# Altium project ETRX_Shield.PrjPcb (part 1 of 3)
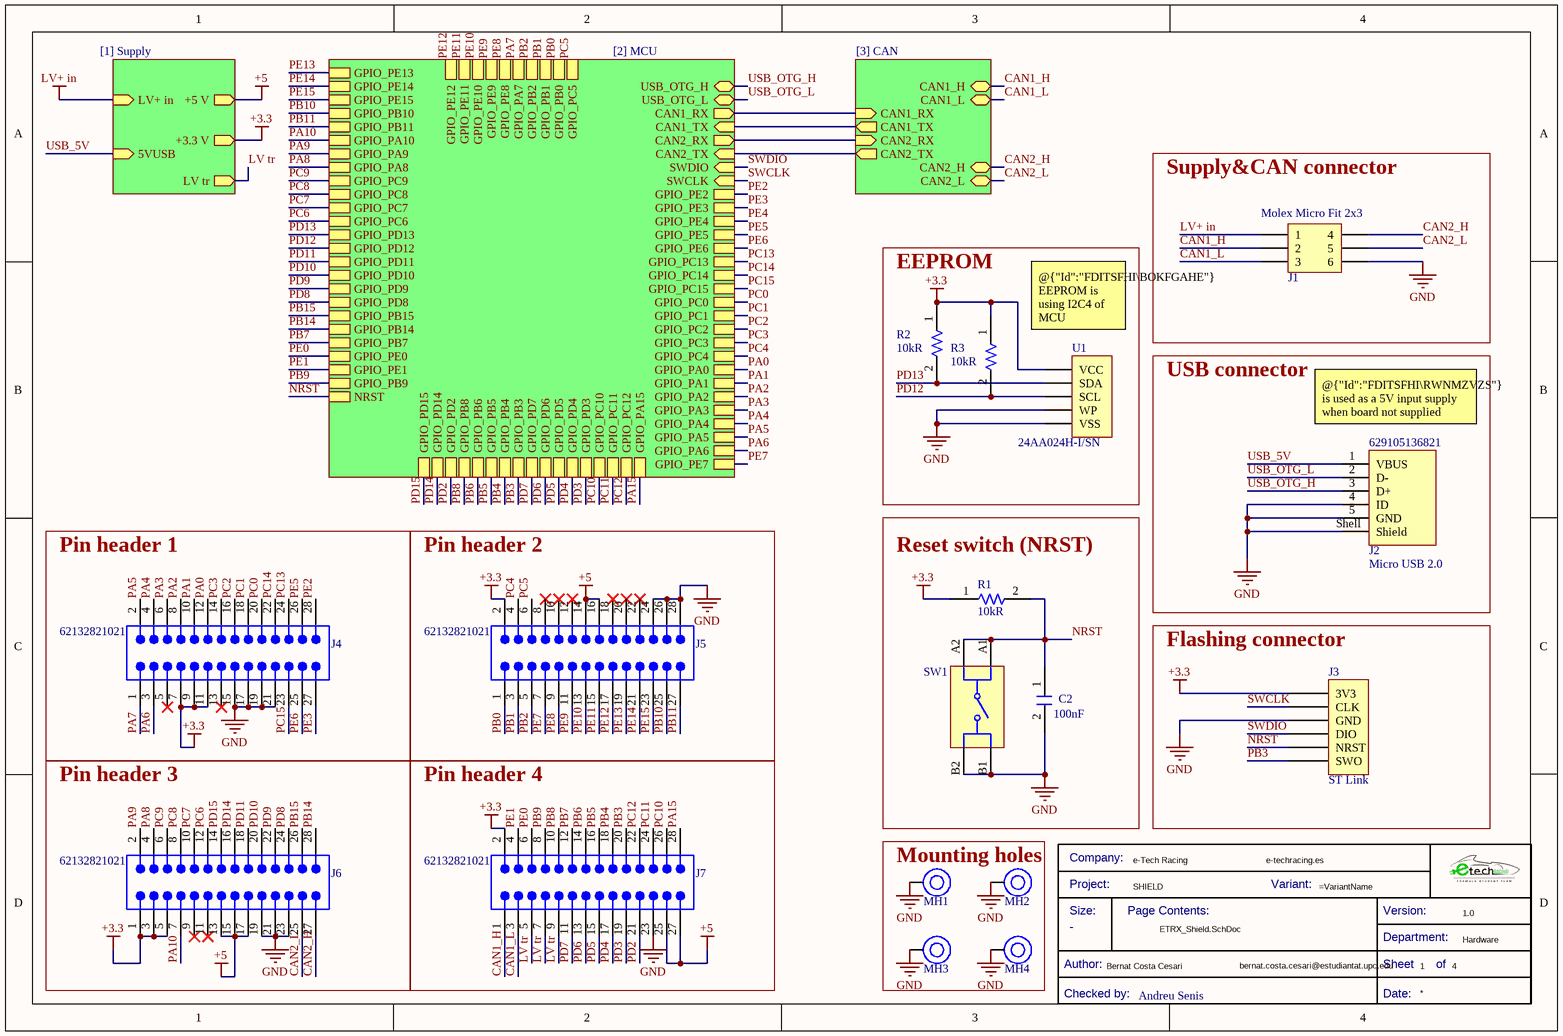
[diagram p0: ETRX_Shield.SchDoc]
Company: e-Tech Racing; Department: Hardware; DesignedByURL: e-techracing.es; DesignerMail: bernat.costa.cesari@estudiantat.upc.edu; DesignerName: Bernat Costa Cesari; Project: SHIELD; ReviewerName: Andreu Senis; Version: 1.0
4 sheets, 119 parts. Net scope: hierarchical (ports join the sheet entries above them; power ports are global).
Sheets:
  ETRX_Shield.SchDoc
    [1] Supply = [1] Supply.SchDoc
    [2] MCU = [2] MCU.SchDoc
    [3] CAN = [3] CAN.SchDoc

## Sheet ETRX_Shield.SchDoc
size A4; DocumentNumber: 1; SheetNumber: 1; SheetTotal: 4

### Parts
*  Checked by:: Andreu Senis  (hidden comment: Title Block_template)  (graphical)
C2  Capacitance: 100nF  [C0805FNPC-R]  (hidden comment: 885012207098)
J1  Molex Micro Fit 2x3  [J_MicroFit_2x3_V]
J2  629105136821  [629105136821]
J3  ST Link  [J_STLink_PinHeader]
J4  62132821021  [62132821021]
J5  62132821021  [62132821021]
J6  62132821021  [62132821021]
J7  62132821021  [62132821021]
MH1  Mounting_Hole_M3  [Mounting_Hole_M3]  (value not drawn)
MH2  Mounting_Hole_M3  [Mounting_Hole_M3]  (value not drawn)
MH3  Mounting_Hole_M3  [Mounting_Hole_M3]  (value not drawn)
MH4  Mounting_Hole_M3  [Mounting_Hole_M3]  (value not drawn)
R1  Resistance: 10kR  [R0805FTK]  (hidden comment: CR0805-JW-103ELF)
R2  Resistance: 10kR  [R0805FTK]  (hidden comment: CR0805-JW-103ELF)
R3  Resistance: 10kR  [R0805FTK]  (hidden comment: CR0805-JW-103ELF)
SW1  430773034825  [WS-TASV_L6W6H3.4_4307x30348xx]  (value not drawn)
U1  24AA024H-I/SN  [SOIC, 8-Leads 1,27mm]

### Blocks framed on the sheet
Supply&CAN connector: J1
EEPROM: R2 R3 U1
USB connector: J2
Reset switch (NRST): C2 R1 SW1
Pin header 1: J4
Pin header 2: J5
Flashing connector: J3
Pin header 3: J6
Pin header 4: J7
Mounting holes: MH1-MH4

### Sub-sheets
[1] Supply = [1] Supply: LV+ in (in), +5 V (out), +3.3 V (out), LV tr (out), 5VUSB (in)
[2] MCU = [2] MCU: CAN1_RX (out), CAN1_TX (in), CAN2_RX (out), CAN2_TX (in), USB_OTG_H (bidir), USB_OTG_L (bidir), SWDIO (in), SWCLK (in), GPIO_PE2, GPIO_PE3, GPIO_PE4, GPIO_PE5, GPIO_PC13, GPIO_PC14, GPIO_PC15, GPIO_PC0, GPIO_PC1, GPIO_PC2, GPIO_PC3, GPIO_PA0, GPIO_PA1, GPIO_PA2, GPIO_PA3, GPIO_PA4, GPIO_PA5, GPIO_PC4, GPIO_PC5, GPIO_PB0, GPIO_PB1, GPIO_PB2, GPIO_PE8, GPIO_PE9, GPIO_PE10, GPIO_PE11, GPIO_PE12, GPIO_PE13, GPIO_PE14, GPIO_PE15, GPIO_PB10, GPIO_PB11, GPIO_PA8, GPIO_PC9, GPIO_PC8, GPIO_PC7, GPIO_PC6, GPIO_PD13, GPIO_PD12, GPIO_PD11, GPIO_PD10, GPIO_PD9, GPIO_PD8, GPIO_PB15, GPIO_PB14, GPIO_PB7, GPIO_PE1, GPIO_PE0, GPIO_PB9, GPIO_PB8, GPIO_PB6, GPIO_PB5, GPIO_PB4, GPIO_PB3, GPIO_PD7, GPIO_PD6, GPIO_PD5, GPIO_PD4, GPIO_PD3, GPIO_PD2, GPIO_PC12, GPIO_PC11, GPIO_PC10, GPIO_PA15, GPIO_PA10, GPIO_PE6, GPIO_PA6, GPIO_PA7, GPIO_PE7, NRST, GPIO_PD14, GPIO_PD15, GPIO_PA9
[3] CAN = [3] CAN: CAN1_H (bidir), CAN1_L (bidir), CAN2_H (bidir), CAN2_L (bidir), CAN1_RX (in), CAN2_RX (in), CAN1_TX (out), CAN2_TX (out)

### Nets
+3.3: J3.1(3V3) J4.7 J4.9 J4.11 J5.2 J6.1 J6.3 J6.5 J7.2 R1.1 R2.1 R3.1 U1.8(VCC) ; sheet [1] Supply/+3.3 V
+5: J5.14 J5.16 J6.13 J6.15 J6.17 J7.25 J7.27 ; sheet [1] Supply/+5 V
GND: C2.2 J1.6 J2.4(ID) J2.5(GND) J2.Shell(Shield) J3.3(GND) J4.15 J4.17 J4.19 J4.21 J5.24 J5.26 J5.28 J6.19 J6.21 J6.23 J7.23 MH1.1 MH2.1 MH3.1 MH4.1 SW1.B1 SW1.B2 U1.4(VSS) U1.7(WP)
LV+ in: J1.1 ; sheet [1] Supply/LV+ in
CAN1_H: J1.2 J7.1 ; sheet [3] CAN/CAN1_H
CAN1_L: J1.3 J7.3 ; sheet [3] CAN/CAN1_L
CAN1_RX: sheet [2] MCU/CAN1_RX, sheet [3] CAN/CAN1_RX
CAN1_TX: sheet [2] MCU/CAN1_TX, sheet [3] CAN/CAN1_TX
CAN2_H: J1.4 J6.27 ; sheet [3] CAN/CAN2_H
CAN2_L: J1.5 J6.25 ; sheet [3] CAN/CAN2_L
CAN2_RX: sheet [2] MCU/CAN2_RX, sheet [3] CAN/CAN2_RX
CAN2_TX: sheet [2] MCU/CAN2_TX, sheet [3] CAN/CAN2_TX
LV tr: J7.5 J7.7 J7.9 ; sheet [1] Supply/LV tr
NRST: C2.1 J3.5(NRST) R1.2 SW1.A1 SW1.A2 ; sheet [2] MCU/NRST
PA0: J4.12 ; sheet [2] MCU/GPIO_PA0
PA1: J4.10 ; sheet [2] MCU/GPIO_PA1
PA2: J4.8 ; sheet [2] MCU/GPIO_PA2  [project net LED_PA2]
PA3: J4.6 ; sheet [2] MCU/GPIO_PA3  [project net LED_PA3]
PA4: J4.4 ; sheet [2] MCU/GPIO_PA4  [project net LED_PA4]
PA5: J4.2 ; sheet [2] MCU/GPIO_PA5
PA6: J4.3 ; sheet [2] MCU/GPIO_PA6
PA7: J4.1 ; sheet [2] MCU/GPIO_PA7
PA8: J6.4 ; sheet [2] MCU/GPIO_PA8
PA9: J6.2 ; sheet [2] MCU/GPIO_PA9
PA10: J6.7 ; sheet [2] MCU/GPIO_PA10
PA15: J7.28 ; sheet [2] MCU/GPIO_PA15
PB0: J5.1 ; sheet [2] MCU/GPIO_PB0
PB1: J5.3 ; sheet [2] MCU/GPIO_PB1
PB2: J5.5 ; sheet [2] MCU/GPIO_PB2
PB3: J3.6(SWO) J7.20 ; sheet [2] MCU/GPIO_PB3
PB4: J7.18 ; sheet [2] MCU/GPIO_PB4
PB5: J7.16 ; sheet [2] MCU/GPIO_PB5
PB6: J7.14 ; sheet [2] MCU/GPIO_PB6
PB7: J7.12 ; sheet [2] MCU/GPIO_PB7
PB8: J7.10 ; sheet [2] MCU/GPIO_PB8
PB9: J7.8 ; sheet [2] MCU/GPIO_PB9
PB10: J5.25 ; sheet [2] MCU/GPIO_PB10
PB11: J5.27 ; sheet [2] MCU/GPIO_PB11
PB14: J6.28 ; sheet [2] MCU/GPIO_PB14
PB15: J6.26 ; sheet [2] MCU/GPIO_PB15
PC0: J4.20 ; sheet [2] MCU/GPIO_PC0
PC1: J4.18 ; sheet [2] MCU/GPIO_PC1
PC2: J4.16 ; sheet [2] MCU/GPIO_PC2
PC3: J4.14 ; sheet [2] MCU/GPIO_PC3
PC4: J5.4 ; sheet [2] MCU/GPIO_PC4
PC5: J5.6 ; sheet [2] MCU/GPIO_PC5
PC6: J6.12 ; sheet [2] MCU/GPIO_PC6
PC7: J6.10 ; sheet [2] MCU/GPIO_PC7
PC8: J6.8 ; sheet [2] MCU/GPIO_PC8
PC9: J6.6 ; sheet [2] MCU/GPIO_PC9
PC10: J7.26 ; sheet [2] MCU/GPIO_PC10
PC11: J7.24 ; sheet [2] MCU/GPIO_PC11
PC12: J7.22 ; sheet [2] MCU/GPIO_PC12
PC13: J4.24 ; sheet [2] MCU/GPIO_PC13
PC14: J4.22 ; sheet [2] MCU/GPIO_PC14
PC15: J4.23 ; sheet [2] MCU/GPIO_PC15
PD2: J7.21 ; sheet [2] MCU/GPIO_PD2
PD3: J7.19 ; sheet [2] MCU/GPIO_PD3
PD4: J7.17 ; sheet [2] MCU/GPIO_PD4
PD5: J7.15 ; sheet [2] MCU/GPIO_PD5
PD6: J7.13 ; sheet [2] MCU/GPIO_PD6
PD7: J7.11 ; sheet [2] MCU/GPIO_PD7
PD8: J6.24 ; sheet [2] MCU/GPIO_PD8
PD9: J6.22 ; sheet [2] MCU/GPIO_PD9
PD10: J6.20 ; sheet [2] MCU/GPIO_PD10
PD11: J6.18 ; sheet [2] MCU/GPIO_PD11
PD12: R3.2 U1.6(SCL) ; sheet [2] MCU/GPIO_PD12
PD13: R2.2 U1.5(SDA) ; sheet [2] MCU/GPIO_PD13
PD14: J6.16 ; sheet [2] MCU/GPIO_PD14
PD15: J6.14 ; sheet [2] MCU/GPIO_PD15
PE0: J7.6 ; sheet [2] MCU/GPIO_PE0
PE1: J7.4 ; sheet [2] MCU/GPIO_PE1
PE2: J4.28 ; sheet [2] MCU/GPIO_PE2
PE3: J4.27 ; sheet [2] MCU/GPIO_PE3
PE5: J4.26 ; sheet [2] MCU/GPIO_PE5
PE6: J4.25 ; sheet [2] MCU/GPIO_PE6
PE7: J5.7 ; sheet [2] MCU/GPIO_PE7
PE8: J5.9 ; sheet [2] MCU/GPIO_PE8
PE9: J5.11 ; sheet [2] MCU/GPIO_PE9
PE10: J5.13 ; sheet [2] MCU/GPIO_PE10
PE11: J5.15 ; sheet [2] MCU/GPIO_PE11
PE12: J5.17 ; sheet [2] MCU/GPIO_PE12
PE13: J5.19 ; sheet [2] MCU/GPIO_PE13
PE14: J5.21 ; sheet [2] MCU/GPIO_PE14
PE15: J5.23 ; sheet [2] MCU/GPIO_PE15
SWCLK: J3.2(CLK) ; sheet [2] MCU/SWCLK
SWDIO: J3.4(DIO) ; sheet [2] MCU/SWDIO
USB_5V: J2.1(VBUS) ; sheet [1] Supply/5VUSB  [project net USB5V]
USB_OTG_H: J2.3(D+) ; sheet [2] MCU/USB_OTG_H
USB_OTG_L: J2.2(D-) ; sheet [2] MCU/USB_OTG_L

Not connected (* = marked no-connect by the designer): J4 5* 13*; J5 8* 10* 12* 18* 20* 22*; J6 9* 11*

### Notes on the sheet
- @{"Id":"FDITSFHI\BOKFGAHE"} EEPROM is using I2C4 of MCU
- (near J2) @{"Id":"FDITSFHI\RWNMZVZS"} is used as a 5V input supply when board not supplied externaly
- (near J2) Micro USB 2.0
- (in symbol Title Block_template) Company:; Project:; Variant:; Size:; Page Contents:; Version:; Department:; Author:; Sheet; of; Checked by:; Date:

### Library data of the parts
* = Title Block_template: Standard Title Block; .Creator: GP; Category: Title Block; .PCBcheck: GP; .SCHcheck: GP; Size: -
C2 = C100n-50V-0805FNPC-X7R: Cap, 0.1ΜF, 50V, 10%, X7R, 0805; Manufacturer 1: Wurth Electronics; .Creator: DR; Supplier 1: RSComponents; Manufacturer Part Number 1: 885012207098; RoHS: Yes; Category: Ceramic Capacitors; Stock 1: 8000; Pricing 1: 100=0,10200, 500=0,07100, 2000=0,06100 (GBP); Mount: Surface Mount; Case/Package: 0805; Case Code (Metric): 2012; Case Code (Imperial): 0805; Min Operating Temperature: -55°C; Max Operating Temperature: 125°C; Packaging: Cut Tape; Voltage Rating: 50V; Dielectric: X7R; Tolerance: 10%; Voltage Rating (DC): 50V; Length: 0.079inch; Width: 0.049inch; Thickness: 0.035inch; REACH SVHC: Unknown; RoHS Compliant: Yes; ComponentLink1URL: http://www.farnell.com/datasheets/1958498.pdf?src-supplier=Farnell; ComponentLink1Description: http://www.farnell.com/datasheets/1958498.pdf?src-supplier=Farnell; ComponentLink2URL: http://www.farnell.com/datasheets/1958498.pdf?src-supplier=Element14; ComponentLink2Description: http://www.farnell.com/datasheets/1958498.pdf?src-supplier=Element14; ComponentLink3URL: https://katalog.we-online.de/pbs/datasheet/885012207098.pdf?src-supplier=Digi-Key; ComponentLink3Description: https://katalog.we-online.de/pbs/datasheet/885012207098.pdf?src-supplier=Digi-Key; ComponentLink4URL: http://www.farnell.com/datasheets/1958498.pdf?src-supplier=Newark; ComponentLink4Description: http://www.farnell.com/datasheets/1958498.pdf?src-supplier=Newark; Supplier Part Number 1: 1813493
J1 = J_MicroFit_2x3_V: Micro fit Header, 2 Row, Vertical, Polarizing Peg, 6 Pin, Tin Plate, SMT/Glow Wire, Kinked Leads; Manufacturer Part Number: 43045-0612; .Creator: DO; ComponentLink8Description: Where buy it; ComponentLink8URL: https://www.molex.com/molex/products/part-detail/pcb_headers/0430450612; Supplier 1: RSComponents; Manufacturer: Molex; RoHS: Yes; Category: Headers and Wire Housings; Stock 1: 2635; Pricing 1: 5=1,45500, 100=1,26700, 375=1,08900, 1500=0,90900, 3000=0,72900 (USD); ComponentLink1URL: https://www.molex.com/pdm_docs/sd/430450612_sd.pdf; ComponentLink1Description: Datasheet; ComponentLink2URL: https://datasheet.ciiva.com/11748/0900766b800bd7d2-11748707.pdf?src-supplier=RSComponents; ComponentLink2Description: https://datasheet.ciiva.com/11748/0900766b800bd7d2-11748707.pdf?src-supplier=RSComponents; ComponentLink3URL: https://datasheet.ciiva.com/19462/883464-19462371.pdf?src-supplier=Jameco; ComponentLink3Description: https://datasheet.ciiva.com/19462/883464-19462371.pdf?src-supplier=Jameco; ComponentLink4URL: https://datasheet.ciiva.com/30194/128550430450612-pcb-headers-30194512.pdf?src-supplier=Onlinecomponents.com; ComponentLink4Description: https://datasheet.ciiva.com/30194/128550430450612-pcb-headers-30194512.pdf?src-supplier=Onlinecomponents.com; ComponentLink5URL: https://datasheet.ciiva.com/9468/0430450612-pcb-headers-9468492.pdf?src-supplier=Avnet; ComponentLink5Description: https://datasheet.ciiva.com/9468/0430450612-pcb-headers-9468492.pdf?src-supplier=Avnet; Supplier Part Number 1: 2332898
J2 = 629105136821: WR-COM Micro USB 2.0 SMT Type B Horizontal 5 Contacts; Manufacturer: Wurth Elektronik; Match Code: WR-USB; Gender: Receptacle; Interface Type: Type B; Number of Ports: 1; Rated Current: 1A; Working Voltage: 30V (AC); Manufacturer Part Number: 629105136821; Category: Input/Output Connectors; ComponentLink1Description: Website Link; ComponentLink1URL: https://www.we-online.com/redexpert/article/629105136821?ad; ComponentLink2Description: Datasheet Link; ComponentLink2URL: https://www.we-online.com/redexpert/spec/629105136821?ad; Mount: Surface Mount; Operating Temperature Max: 105°C; Operating Temperature Min: -40°C; Packaging: Tape and Reel; Application: Micro USB 2.0; Number of Pins: 5; Orientation: Horizontal
J3 = J_STLink_STM32_PinHeader_1x6
J4-J7 = 62132821021: WR-PHD Pin Header, SMT, Vertical, pitch 1.27mm, 2 Row, 28P; Manufacturer: Wurth Elektronik; Contact Resistance: 20mΩ; Rated Current: 1A; Working Voltage: 100V; Withstanding Voltage: 500V; ComponentLink1Description: Website Link; ComponentLink1URL: https://www.we-online.com/redexpert/article/62132821021?ad; ComponentLink2Description: Datasheet Link; ComponentLink2URL: https://www.we-online.com/redexpert/spec/62132821021?ad; Manufacturer Part Number: 62132821021; Category: Board-to-Board Connectors; Match Code: WR-PHD; Mount: Surface Mount; Operating Temperature Max: 105°C; Operating Temperature Min: -40°C; Packaging: Tape and Reel; Gender: Pin Header; Number of Pins: 28; Number of Rows: 2; Orientation: Vertical; Pitch: 1.27mm
R1-R3 = R10k-0805FTK: BOURNS         CR0805-JW-103ELF            Surface Mount Chip Resistor, Thick Film, CR Series, 10 kohm, 125 mW,  5%, 150 V; Temperature Coefficient: 200ppm/°C; Power Rating: 125mW; Voltage Rating: 150V; Voltage Rating (DC): 100V; .Creator: DR; Supplier 1: Arrow Electronics; Manufacturer 1: Bourns; Manufacturer Part Number 1: CR0805-JW-103ELF; RoHS: Yes; Category: Chip SMD Resistors; Stock 1: 57566; Pricing 1: 1=0,05790, 10=0,01540, 25=0,01340, 100=0,00340 (USD); Mount: Surface Mount; Case/Package: 0805; Number of Pins: 2; Contact Plating: Tin; Case Code (Metric): 2012; Case Code (Imperial): 0805; Min Operating Temperature: -55°C; Max Operating Temperature: 155°C; Tolerance: 5%; Resistor Type: Thick Film; Package Quantity: 1; Packaging: Tape and Reel; Number of Terminations: 2; Termination: SMD/SMT; Max Power Dissipation: 125mW; Features: Moisture Resistant; Series: CR0805; Construction: Rectangular; Resistance Tolerance: 5%; Technology: THICK FILM; Length: 2mm; Width: 1.25mm; Height: 0.5mm; Depth: 1.25mm; Thickness: 508um; Radiation Hardening: No; REACH SVHC: No SVHC; Military Standard: Not; RoHS Compliant: Yes; ComponentLink1URL: https://datasheet.ciiva.com/11821/0900766b80fcdb72-11821135.pdf?src-supplier=RSComponents; ComponentLink1Description: https://datasheet.ciiva.com/11821/0900766b80fcdb72-11821135.pdf?src-supplier=RSComponents; ComponentLink2URL: https://datasheet.ciiva.com/9122/chpreztr-9122374.pdf?src-supplier=Avnet; ComponentLink2Description: https://datasheet.ciiva.com/9122/chpreztr-9122374.pdf?src-supplier=Avnet; ComponentLink3URL: https://datasheet.ciiva.com/22693/1902866-22693254.pdf?src-supplier=Element14; ComponentLink3Description: https://datasheet.ciiva.com/22693/1902866-22693254.pdf?src-supplier=Element14; ComponentLink4URL: https://datasheet.ciiva.com/7986/691949-7986187.pdf?src-supplier=Element14; ComponentLink4Description: https://datasheet.ciiva.com/7986/691949-7986187.pdf?src-supplier=Element14; ComponentLink5URL: https://datasheet.ciiva.com/30065/159chpreztr-30065976.pdf?src-supplier=Onlinecomponents.com; ComponentLink5Description: https://datasheet.ciiva.com/30065/159chpreztr-30065976.pdf?src-supplier=Onlinecomponents.com; ComponentLink6URL: https://datasheet.ciiva.com/16783/70154685-16783482.pdf?src-supplier=Allied+Electronics; ComponentLink6Description: https://datasheet.ciiva.com/16783/70154685-16783482.pdf?src-supplier=Allied+Electronics; ComponentLink7URL: https://datasheet.ciiva.com/5548/chpreztr-5548491.pdf?src-supplier=Mouser; ComponentLink7Description: https://datasheet.ciiva.com/5548/chpreztr-5548491.pdf?src-supplier=Mouser; ComponentLink8URL: https://datasheet.ciiva.com/6559/chpreztr-6559900.pdf?src-supplier=Digi-Key; ComponentLink8Description: https://datasheet.ciiva.com/6559/chpreztr-6559900.pdf?src-supplier=Digi-Key; ComponentLink9URL: https://datasheet.ciiva.com/6559/chpreztr-6559901.pdf?src-supplier=Digi-Key; ComponentLink9Description: https://datasheet.ciiva.com/6559/chpreztr-6559901.pdf?src-supplier=Digi-Key; ComponentLink10URL: https://datasheet.ciiva.com/7985/1856384-7985869.pdf?src-supplier=Element14; ComponentLink10Description: https://datasheet.ciiva.com/7985/1856384-7985869.pdf?src-supplier=Element14; ComponentLink11URL: https://datasheet.ciiva.com/48692/001055517-da-01-en-smd-wid-cr0805-jw-103elf-10k-ohm-1-8w-48692118.pdf?src-supplier=Conrad; ComponentLink11Description: https://datasheet.ciiva.com/48692/001055517-da-01-en-smd-wid-cr0805-jw-103elf-10k-ohm-1-8w-48692118.pdf?src-supplier=Conrad; Supplier Part Number 1: CR0805-JW-103ELF
SW1 = 430773034825: WS-TASV J-Hook SMT Hermetic Tact Switch, L6 x W6 x H3.4mm, 250g, SPST-NO, 12V, 50mA; Manufacturer: Wurth Elektronik; Washable: Yes; Manufacturer Part Number: 430773034825; Category: Tact Switches; Match Code: WS-TASV; ComponentLink1Description: Website Link; ComponentLink1URL: https://www.we-online.com/redexpert/article/430773034825?ad; ComponentLink2Description: Datasheet Link; ComponentLink2URL: https://www.we-online.com/redexpert/spec/430773034825?ad; Mount: Surface Mount; Operating Temperature Max: 85°C; Operating Temperature Min: -40°C; Packaging: Tape and Reel; Length: 6mm; Width: 6mm; Height: 3.4mm; Circuit: SPST-NO; Contact Material: Stainless Steel; Contact Plating: Silver; Operation Force: 250g; Rated Current: 50mA; Rated Voltage (DC): 12V; Terminal Material: Copper Alloy; Terminal Plating: Silver
U1 = EEPROM 24AA02I2C 2K Microchip: 24AA02 / 2Kb I2C compatible 2-wire Serial EEPROM; Supplier 1: Arrow Electronics; Supplier Part Number 1: 24AA02-I/SN; ComponentLink1Description: Datasheet; ComponentLink1URL: https://ww1.microchip.com/downloads/aemDocuments/documents/MPD/ProductDocuments/DataSheets/24AA02-24LC02B-24FC02-2K-I2C-Serial-EEPROM-20001709N.pdf

## Sheet [1] Supply.SchDoc
size A4; DocumentNumber: 2; SheetNumber: 2; SheetTotal: 4
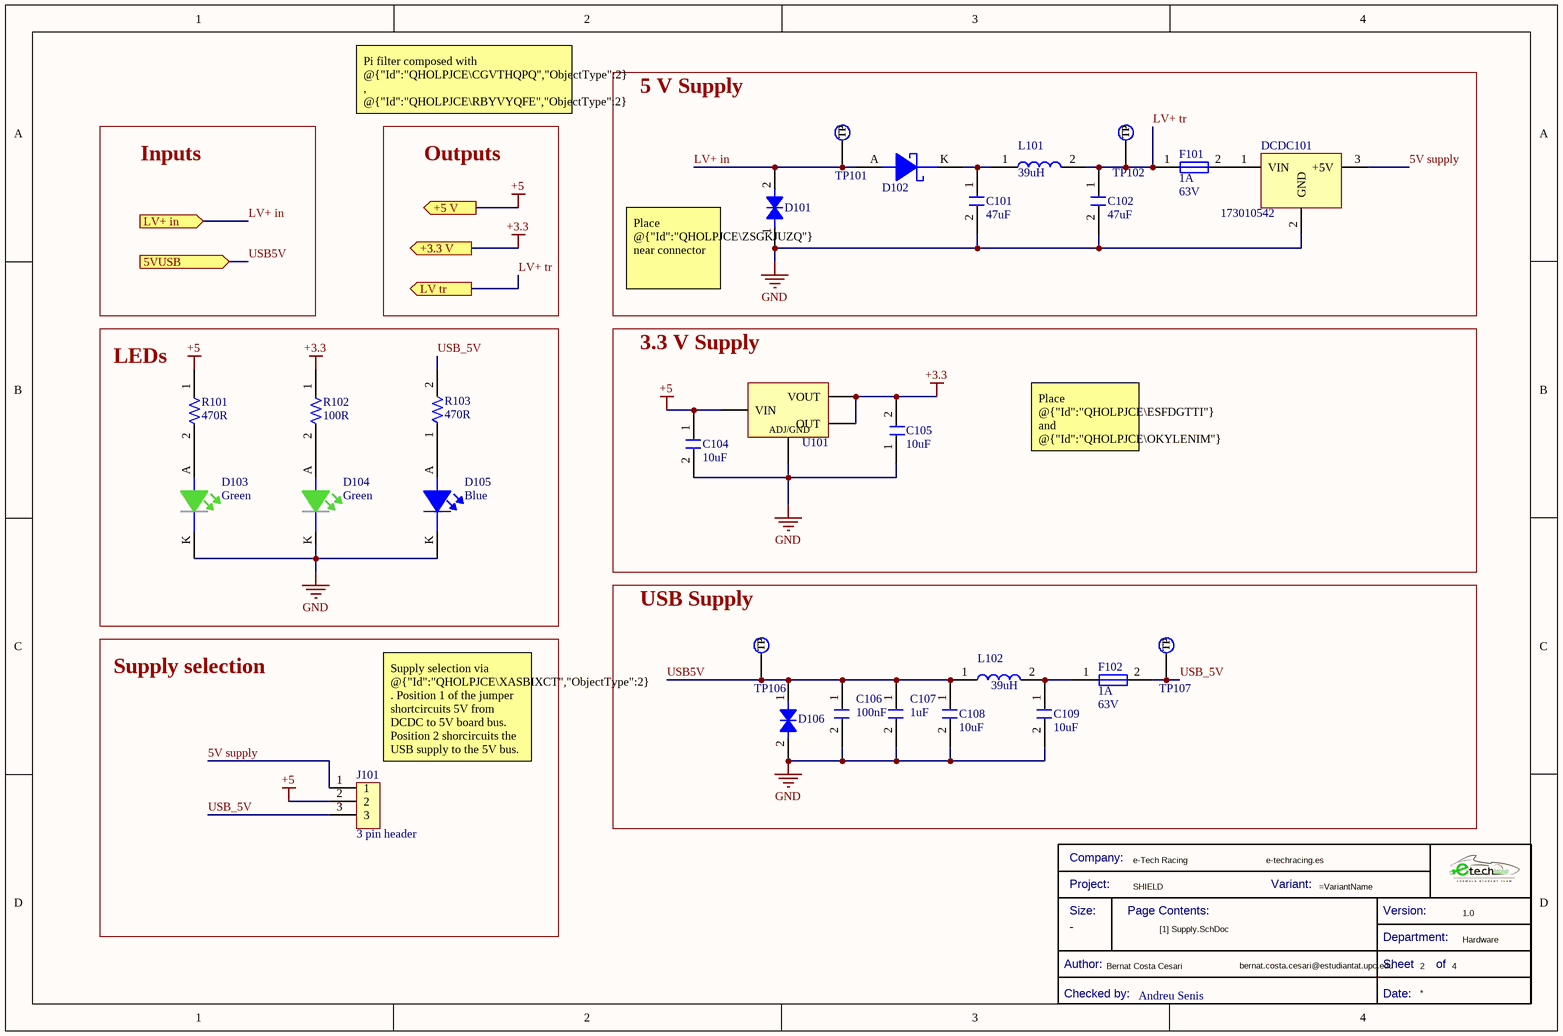
[diagram p1: [1] Supply.SchDoc]

### Parts
(Parts that share a designator on the sheet are numbered #1, #2 ... from top to bottom, then left to right.)
*?#1  Checked by:: Andreu Senis  (hidden comment: Title Block_template)  (graphical)
C101  Capacitance: 47uF  [C6.8n-2kV-1210FNPMLCC-X7R]  (hidden comment: C1210C682KGRACAUTO)
C102  Capacitance: 47uF  [C6.8n-2kV-1210FNPMLCC-X7R]  (hidden comment: C1210C682KGRACAUTO)
C104  Capacitance: 10uF  [C0805FNPC-R]  (hidden comment: 885012107014)
C105  Capacitance: 10uF  [C0805FNPC-R]  (hidden comment: 885012107014)
C106  Capacitance: 100nF  [C0805FNPC-R]  (hidden comment: 885012207098)
C107  Capacitance: 1uF  [C0805FNPC-R]  (hidden comment: 885012207103)
C108  10uF  [C0805FNPC-W]
C109  10uF  [C0805FNPC-W]
D101  824501261  [DTVS-DO-214AC]  (value not drawn)
D102  MBR0530  [DSC-SOD123]  (value not drawn)
D103  Color: Green  [LED_0805_WE]  (hidden comment: 150080GS75000)
D104  Color: Green  [LED_0805_WE]  (hidden comment: 150080GS75000)
D105  Color: Blue  [LED_1206_WE]  (hidden comment: 150120BS75000)
D106  824501131  [DTVS-DO-214AC]  (value not drawn)
DCDC101  173010542  [DCDC_Magi3c]
F101  Current Rating: 1A  Voltage Rating (DC): 63V  [Fuse_1206]  (hidden comment: 0437001.WRA)
F102  Current Rating: 1A  Voltage Rating (DC): 63V  [Fuse_1206]  (hidden comment: 0437001.WRA)
J101  3 pin header  [J3_PINHEADER]
L101  39uH  [L_47u-490mA_CF]
L102  39uH  [L_47u-490mA_CF]
R101  Resistance: 470R  [R0805FTK]  (hidden comment: CR0805-FX-4700GLF)
R102  Resistance: 100R  [R0805FTK]  (hidden comment: CR0805-FX-1000ELF)
R103  Resistance: 470R  [R0805FTK]  (hidden comment: CR0805-FX-4700GLF)
TP101  TestPoint  [TestPoint]  (value not drawn)  (no BOM)
TP102  TestPoint  [TestPoint]  (value not drawn)  (no BOM)
TP106  TestPoint  [TestPoint]  (value not drawn)  (no BOM)
TP107  TestPoint  [TestPoint]  (value not drawn)  (no BOM)
U101  LM1117IMP-3.3/NOPB  [LDO_10V-0.8/3V3-SOT223]  (value not drawn)

### Blocks framed on the sheet
5 V Supply: C101 C102 D101 D102 DCDC101 F101 L101 TP101 TP102
LEDs: D103-D105 R101-R103
3.3 V Supply: C104 C105 U101
USB Supply: C106-C109 D106 F102 L102 TP106 TP107
Supply selection: J101

### Ports
5VUSB (in), +3.3 V (out), +5 V (out), LV tr (out), LV+ in (in)

### Nets
+3.3: C105.2 R102.1 U101.2(OUT) U101.4(VOUT) ; port +3.3 V
+5: C104.1 J101.2 R101.1 U101.3(VIN) ; port +5 V
GND: C101.2 C102.2 C104.2 C105.1 C106.2 C107.2 C108.2 C109.2 D101.1 D103.K D104.K D105.K D106.2 DCDC101.2(GND) U101.1(ADJ/GND)
LV+ in: D101.2 D102.A TP101.1(TP) ; port LV+ in
5V supply: DCDC101.3(+5V) J101.1
LV+ tr: C102.1 F101.1 L101.2 TP102.1(TP) ; port LV tr  [project net LV tr]
USB5V: C106.1 C107.1 C108.1 D106.1 L102.1 TP106.1(TP) ; port 5VUSB
USB_5V: F102.2 J101.3 R103.2 TP107.1(TP)
NetC101_1: C101.1 D102.K L101.1
NetC109_1: C109.1 F102.1 L102.2
NetD103_A: D103.A R101.2
NetD104_A: D104.A R102.2
NetD105_A: D105.A R103.1
NetDCDC101_1: DCDC101.1(VIN) F101.2

### Notes on the sheet
- Pi filter composed with @{"Id":"QHOLPJCE\CGVTHQPQ","ObjectType":2} , @{"Id":"QHOLPJCE\RBYVYQFE","ObjectType":2} and @{"Id":"QHOLPJCE\QHWORVIP"} is calculated to be cutting all frequencies higher than 7340 Hz
- Inputs
- Outputs
- Place @{"Id":"QHOLPJCE\ZSGKJUZQ"} near connector
- Place @{"Id":"QHOLPJCE\ESFDGTTI"} and @{"Id":"QHOLPJCE\OKYLENIM"} near @{"Id":"QHOLPJCE\XKTUAFZT"}
- (near J101) Supply selection via @{"Id":"QHOLPJCE\XASBIXCT","ObjectType":2} . Position 1 of the jumper shortcircuits 5V from DCDC to 5V board bus. Position 2 shorcircuits the USB supply to the 5V bus.
- (in symbol Title Block_template) Company:; Project:; Variant:; Size:; Page Contents:; Version:; Department:; Author:; Sheet; of; Checked by:; Date:

### Library data of the parts
*?#1 = Title Block_template: Standard Title Block; .Creator: GP; Category: Title Block; .PCBcheck: GP; .SCHcheck: GP; Size: -
C101 C102 = C6.8n-2kV-1210FNPMLCC-X7R: Cap, AEC-Q200, 6800PF, 2KV, Mlcc, 1210;; Manufacturer: KEMET; Dielectric: X7R; Tolerance: 10%; .Creator: DR; Supplier 1: Digi-Key; Manufacturer Part Number: C1210C682KGRACAUTO; RoHS: Yes; Category: Ceramic Capacitors; Stock 1: 1000; Pricing 1: 1=0,78000, 10=0,55500, 50=0,41940, 100=0,36530, 500=0,27060 (USD); Case/Package: 1210; Case Code (Imperial): 1210; Case Code (Metric): 3225; Weight: 0.000564oz; Min Operating Temperature: -55°C; Max Operating Temperature: 125°C; Packaging: Tape and Reel; Termination: SMD/SMT; Voltage Rating (DC): 2kV; Package Quantity: 1000; Length: 3.2mm; Width: 2.5mm; RoHS Compliant: Yes; ComponentLink1URL: http://www.mouser.com/ds/2/212/KEM_C1010_X7R_HV_SMD-345925.pdf?src-supplier=Mouser; ComponentLink1Description: http://www.mouser.com/ds/2/212/KEM_C1010_X7R_HV_SMD-345925.pdf?src-supplier=Mouser; Supplier Part Number 1: 399-C1210C682KGRACAUTOCT-ND
C104 C105 = C10u-16V-0805FNPC-X5R: Multilayer Ceramic Capacitor, Wcap-Csgp Series, 10 F, 20%, X5R, 16 V, 0805 [2012 Metric] Rohs Compliant: Yes; Manufacturer 1: Wurth Electronics; Voltage Rating: 16V; .Creator: DR; Supplier 1: RSComponents; Manufacturer Part Number 1: 885012107014; RoHS: Yes; Category: Ceramic Capacitors; Stock 1: 81550; Pricing 1: 50=0,21000, 250=0,20200, 500=0,19100, 1000=0,17400, 2500=0,14700 (GBP); Mount: Surface Mount; Case/Package: 0805; Case Code (Metric): 2012; Case Code (Imperial): 0805; Min Operating Temperature: -55°C; Max Operating Temperature: 85°C; Packaging: Cut Tape; Dielectric: X5R; Tolerance: 20%; Voltage Rating (DC): 16V; Length: 0.079inch; Width: 0.049inch; Thickness: 0.057inch; REACH SVHC: Unknown; RoHS Compliant: Yes; ComponentLink1URL: http://www.farnell.com/datasheets/1958454.pdf?src-supplier=Farnell; ComponentLink1Description: http://www.farnell.com/datasheets/1958454.pdf?src-supplier=Farnell; ComponentLink2URL: http://www.farnell.com/datasheets/1958454.pdf?src-supplier=Element14; ComponentLink2Description: http://www.farnell.com/datasheets/1958454.pdf?src-supplier=Element14; ComponentLink3URL: https://katalog.we-online.de/pbs/datasheet/885012107014.pdf?src-supplier=Digi-Key; ComponentLink3Description: https://katalog.we-online.de/pbs/datasheet/885012107014.pdf?src-supplier=Digi-Key; ComponentLink4URL: http://www.farnell.com/datasheets/1958454.pdf?src-supplier=Newark; ComponentLink4Description: http://www.farnell.com/datasheets/1958454.pdf?src-supplier=Newark; Supplier Part Number 1: 1813526
C106 = C100n-50V-0805FNPC-X7R: as C2 on sheet ETRX_Shield; Supplier 1: RSComponents; Manufacturer Part Number 1: 885012207098; RoHS: Yes; Category: Ceramic Capacitors; Stock 1: 8000; Pricing 1: 100=0,10200, 500=0,07100, 2000=0,06100 (GBP); Mount: Surface Mount; Case/Package: 0805; Case Code (Metric): 2012; Case Code (Imperial): 0805; Min Operating Temperature: -55°C; Max Operating Temperature: 125°C; Packaging: Cut Tape; Voltage Rating: 50V; Dielectric: X7R; Tolerance: 10%; Voltage Rating (DC): 50V; Length: 0.079inch; Width: 0.049inch; Thickness: 0.035inch; REACH SVHC: Unknown; RoHS Compliant: Yes; ComponentLink1URL: http://www.farnell.com/datasheets/1958498.pdf?src-supplier=Farnell; ComponentLink1Description: http://www.farnell.com/datasheets/1958498.pdf?src-supplier=Farnell; ComponentLink2URL: http://www.farnell.com/datasheets/1958498.pdf?src-supplier=Element14; ComponentLink2Description: http://www.farnell.com/datasheets/1958498.pdf?src-supplier=Element14; ComponentLink3URL: https://katalog.we-online.de/pbs/datasheet/885012207098.pdf?src-supplier=Digi-Key; ComponentLink3Description: https://katalog.we-online.de/pbs/datasheet/885012207098.pdf?src-supplier=Digi-Key; ComponentLink4URL: http://www.farnell.com/datasheets/1958498.pdf?src-supplier=Newark; ComponentLink4Description: http://www.farnell.com/datasheets/1958498.pdf?src-supplier=Newark; Supplier Part Number 1: 1813493
C107 = C1u-50V-0805FNPC-X7R: Multilayer Ceramic Capacitor, Wcap-Csgp Series, 1 F, 10%, X7R, 50 V, 0805 [2012 Metric] Rohs Compliant: Yes; Manufacturer 1: Wurth Electronics; Voltage Rating: 50V; .Creator: GP; Supplier 1: RSComponents; Manufacturer Part Number 1: 885012207103; RoHS: Yes; Category: Ceramic Capacitors; Stock 1: 5100; Pricing 1: 50=0,27200, 250=0,25300, 500=0,22800, 1250=0,20100, 2500=0,17100 (GBP); Mount: Surface Mount; Case/Package: 0805; Case Code (Metric): 2012; Case Code (Imperial): 0805; Min Operating Temperature: -55°C; Max Operating Temperature: 85°C; Packaging: Cut Tape; Dielectric: X7R; Tolerance: 10%; Voltage Rating (DC): 50V; Length: 0.079inch; Width: 0.049inch; Thickness: 0.053inch; REACH SVHC: Unknown; RoHS Compliant: Yes; ComponentLink1URL: http://www.farnell.com/datasheets/1958501.pdf?src-supplier=Farnell; ComponentLink1Description: http://www.farnell.com/datasheets/1958501.pdf?src-supplier=Farnell; ComponentLink2URL: http://www.farnell.com/datasheets/1958501.pdf?src-supplier=Element14; ComponentLink2Description: http://www.farnell.com/datasheets/1958501.pdf?src-supplier=Element14; ComponentLink3URL: https://katalog.we-online.de/pbs/datasheet/885012107003.pdf?src-supplier=Digi-Key; ComponentLink3Description: https://katalog.we-online.de/pbs/datasheet/885012107003.pdf?src-supplier=Digi-Key; ComponentLink4URL: http://www.farnell.com/datasheets/1958501.pdf?src-supplier=Newark; ComponentLink4Description: http://www.farnell.com/datasheets/1958501.pdf?src-supplier=Newark; Supplier Part Number 1: 1813523
C108 C109 = C10uF-50V-0805FNPC
D101 = DTVS-26V-DO-214AC: TVS diode [Würth Elektronik] 824501261 TVS diode; Manufacturer: Wurth Electronics; Number of Bidirectional Channels: 1; Reverse Standoff Voltage: 26V; Min Breakdown Voltage: 30.4V; Clamping Voltage: 42.1V; Peak Pulse Power: 400W; Power Line Protection: No; Polarity: Bidirectional; Peak Pulse Current: 9.5A; .Creator: DO; Supplier 1: RSComponents; Manufacturer Part Number: 824501261; RoHS: Yes; Category: TVS Diodes; Stock 1: 1; Pricing 1: 50=0,29400, 250=0,26100, 500=0,21200, 1000=0,20100, 2000=0,19600 (USD); Mount: Surface Mount; Number of Pins: 2; Min Operating Temperature: -65°C; Max Operating Temperature: 150°C; Packaging: Cut Tape; Max Breakdown Voltage: 30.4V; Resistor Type: Zener; REACH SVHC: Unknown; RoHS Compliant: Yes; ComponentLink1URL: http://www.farnell.com/datasheets/2036389.pdf?src-supplier=Farnell; ComponentLink1Description: http://www.farnell.com/datasheets/2036389.pdf?src-supplier=Farnell; ComponentLink2URL: http://www.farnell.com/datasheets/2036389.pdf?src-supplier=Element14; ComponentLink2Description: http://www.farnell.com/datasheets/2036389.pdf?src-supplier=Element14; ComponentLink3URL: https://katalog.we-online.de/pbs/datasheet/824501261.pdf?src-supplier=Digi-Key; ComponentLink3Description: https://katalog.we-online.de/pbs/datasheet/824501261.pdf?src-supplier=Digi-Key; Supplier Part Number 1: 9217305; ComponentLink4Description: Where buy it; ComponentLink4URL: https://www.we-online.com/catalog/en/WE-TVSP?sq=824501261#824501261
D102 = DSC-0.5/30-SOD123: VR=30V IF=500mA 30pF P=410mW; Element Configuration: Single; Forward Voltage: 430mV; Peak Non-Repetitive Surge Current: 5.5A; Average Rectified Current: 500mA; Max Reverse Leakage Current: 130uA; Max Reverse Voltage (DC): 30V; Polarity: Standard; .Creator: GP; Category: Diode; ComponentLink1Description: Datasheet; ComponentLink1URL: *; ComponentLink2Description: Where buy it; ComponentLink2URL: *; Supplier 1: Newark; Stock 1: 9; Pricing 1: 1=0,34400, 10=0,23900, 100=0,12200, 500=0,10000 (USD); Mount: Surface Mount; Contact Plating: Tin,Matte; Weight: 0.03g; Package Quantity: 1; Max Surge Current: 5.5A; Forward Current: 500mA; Max Reverse Current: 130uA; Max Repetitive Reverse Voltage (Vrrm): 30V; Max Forward Surge Current (Ifsm): 5.5A; Voltage Rating (DC): 30V; Current Rating: 500mA; Output Current: 500mA; Series: -; Length: 2.7mm; Width: 1.6mm; Height: 1.03mm; Radiation Hardening: No; RoHS Compliant: Yes; REACH SVHC: No SVHC; Lead Free: Lead Free; ComponentLink3URL: https://datasheet.ciiva.com/30479/0900766b810e2512-30479401.pdf?src-supplier=RSComponents; ComponentLink3Description: https://datasheet.ciiva.com/30479/0900766b810e2512-30479401.pdf?src-supplier=RSComponents; ComponentLink4URL: https://datasheet.ciiva.com/34301/974753-34301826.pdf?src-supplier=Jameco; ComponentLink4Description: https://datasheet.ciiva.com/34301/974753-34301826.pdf?src-supplier=Jameco; ComponentLink5URL: https://datasheet.ciiva.com/910/mbr0530-910516.pdf?src-supplier=Digi-Key; ComponentLink5Description: https://datasheet.ciiva.com/910/mbr0530-910516.pdf?src-supplier=Digi-Key; ComponentLink6URL: https://datasheet.ciiva.com/25931/mbr0530-25931989.pdf?src-supplier=Avnet+Europe; ComponentLink6Description: https://datasheet.ciiva.com/25931/mbr0530-25931989.pdf?src-supplier=Avnet+Europe; ComponentLink7URL: https://datasheet.ciiva.com/8300/mbr0530-8300905.pdf?src-supplier=Avnet; ComponentLink7Description: https://datasheet.ciiva.com/8300/mbr0530-8300905.pdf?src-supplier=Avnet; ComponentLink8URL: https://datasheet.ciiva.com/17318/mbr0530-17318568.pdf?src-supplier=Future+Electronics; ComponentLink8Description: https://datasheet.ciiva.com/17318/mbr0530-17318568.pdf?src-supplier=Future+Electronics; ComponentLink9URL: https://datasheet.ciiva.com/15144/getdatasheetpartid-86760-15144598.pdf?src-supplier=Verical; ComponentLink9Description: https://datasheet.ciiva.com/15144/getdatasheetpartid-86760-15144598.pdf?src-supplier=Verical; ComponentLink10URL: https://datasheet.ciiva.com/910/mbr0530-910518.pdf?src-supplier=Digi-Key; ComponentLink10Description: https://datasheet.ciiva.com/910/mbr0530-910518.pdf?src-supplier=Digi-Key; Supplier Part Number 1: 15R3453; Parameter 1: *
D103 D104 = LEDGS-0805-450: Led, Green, 520 Nm, 3.2 V, 30 Ma, 450 Mcd Rohs Compliant: Yes; Manufacturer 1: Wurth Electronics; Viewing Angle: 140°; Lens Style: Clear,Rectangular; Luminous Intensity: 450mcd; Forward Voltage: 3.2V; Wavelength: 520nm; Forward Current: 30mA; Test Current: 20mA; .Creator: GP; ComponentLink1Description: Datasheet; ComponentLink1URL: https://www.we-online.com/catalog/datasheet/150080GS75000.pdf; ComponentLink2Description: Where buy it; ComponentLink2URL: https://katalog.we-online.de/en/led/WL-SMCW/150080GS75000; Supplier 1: RSComponents; Manufacturer Part Number 1: 150080GS75000; RoHS: Yes; Category: LEDs; Stock 1: 4350; Pricing 1: 50=0,19300, 500=0,12900, 1000=0,12300, 2000=0,11700, 4000=0,11100 (USD); Mount: Surface Mount; Case/Package: 0805; Case Code (Metric): 2012; Case Code (Imperial): 0805; Min Operating Temperature: -40°C; Max Operating Temperature: 85°C; Package Quantity: 4000; Packaging: Cut Tape; Dominant Wavelength: 520nm; Length: 2mm; Width: 1.25mm; Height: 0.7mm; REACH SVHC: Unknown; RoHS Compliant: Yes; ComponentLink3URL: https://datasheet.ciiva.com/29563/150080gs75000-29563008.pdf?src-supplier=Digi-Key; ComponentLink3Description: https://datasheet.ciiva.com/29563/150080gs75000-29563008.pdf?src-supplier=Digi-Key; ComponentLink4URL: https://datasheet.ciiva.com/29279/759434-da-01-en-chipled-0805-w-kl-gruen-150080gs75000-29279039.pdf?src-supplier=Conrad; ComponentLink4Description: https://datasheet.ciiva.com/29279/759434-da-01-en-chipled-0805-w-kl-gruen-150080gs75000-29279039.pdf?src-supplier=Conrad; Supplier Part Number 1: 8154221
D105 = LEDBS-1206-145: Led, Blue, 470 Nm, 3.2 V, 30 Ma, 145 Mcd Rohs Compliant: Yes; Manufacturer: Wurth Electronics; Luminous Intensity: 145mcd; Viewing Angle: 140°; Wavelength: 470nm; Forward Current: 30mA; Lens Style: Clear,Rectangular; Test Current: 20mA; Forward Voltage: 3.2V; .Creator: GP; Supplier 1: RSComponents; Manufacturer Part Number: 150120BS75000; RoHS: Yes; Category: LEDs; Stock 1: 1; Pricing 1: 50=0,23200, 500=0,16400, 750=0,15500, 1500=0,15000, 3000=0,14200 (USD); Mount: Surface Mount; Case/Package: 1206; Case Code (Metric): 3216; Case Code (Imperial): 1206; Min Operating Temperature: -40°C; Max Operating Temperature: 85°C; Package Quantity: 3000; Packaging: Tape and Reel; Dominant Wavelength: 470nm; Length: 3.2mm; Width: 1.6mm; Height: 0.68mm; REACH SVHC: Unknown; RoHS Compliant: Yes; ComponentLink1URL: https://datasheet.ciiva.com/22656/150120bs75000-22656976.pdf?src-supplier=Element14; ComponentLink1Description: https://datasheet.ciiva.com/22656/150120bs75000-22656976.pdf?src-supplier=Element14; ComponentLink2URL: https://datasheet.ciiva.com/29279/759440-da-01-en-chipled-1206-w-kl-blau-150120bs75000-29279045.pdf?src-supplier=Conrad; ComponentLink2Description: https://datasheet.ciiva.com/29279/759440-da-01-en-chipled-1206-w-kl-blau-150120bs75000-29279045.pdf?src-supplier=Conrad; ComponentLink3URL: https://datasheet.ciiva.com/29561/150120bs75000-29561882.pdf?src-supplier=Digi-Key; ComponentLink3Description: https://datasheet.ciiva.com/29561/150120bs75000-29561882.pdf?src-supplier=Digi-Key; Supplier Part Number 1: 8154243; ComponentLink4Description: Where buy it; ComponentLink4URL: https://www.we-online.com/catalog/en/WL-SMCW?sq=150120BS75000#150120BS75000
D106 = DTVS-13V-DO-214AC: Tvs Diode, 400W, 13V, Bidir, DO-214AC; Manufacturer: Wurth Electronics; Number of Bidirectional Channels: 1; Min Breakdown Voltage: 15.15V; Clamping Voltage: 21.5V; Power Line Protection: No; Polarity: Bidirectional; Peak Pulse Current: 18.6A; .Creator: DO; Supplier 1: Digi-Key; Manufacturer Part Number: 824501131; RoHS: Yes; Category: TVS Diodes; Stock 1: 1000; Pricing 1: 1=0,27000 (USD); Mount: Surface Mount; Number of Pins: 2; Min Operating Temperature: -65°C; Max Operating Temperature: 150°C; Packaging: Cut Tape; Reverse Standoff Voltage: 13V; Peak Pulse Power: 400W; Max Breakdown Voltage: 15.15V; Resistor Type: Zener; REACH SVHC: Unknown; RoHS Compliant: Yes; ComponentLink1URL: https://katalog.we-online.de/pbs/datasheet/824501131.pdf?src-supplier=Digi-Key; ComponentLink1Description: https://katalog.we-online.de/pbs/datasheet/824501131.pdf?src-supplier=Digi-Key; ComponentLink2URL: http://www.farnell.com/datasheets/2036399.pdf?src-supplier=Element14; ComponentLink2Description: http://www.farnell.com/datasheets/2036399.pdf?src-supplier=Element14; ComponentLink3Description: Where buy it; ComponentLink3URL: https://www.we-online.com/catalog/en/WE-TVSP?sq=824501131#824501131; Supplier Part Number 1: 732-824501131CT-ND
DCDC101 = DCDC-42V/5V-1A: Würth Elektronik 8-42V to 5V 1A DC-DC; Manufacturer 1: Wurth Electronics; Number of Outputs: 1; Min Input Voltage: 8V; Max Input Voltage: 42V; Efficiency: 93%; .Creator: DR; Supplier 1: RSComponents; Manufacturer Part Number 1: 173010542; RoHS: Yes; Stock 1: 1; Pricing 1: 1=12,22500, 8=10,96900, 21=10,68900 (USD); Mount: Through Hole; Min Operating Temperature: -40°C; Max Operating Temperature: 85°C; Features: UVLO,OCP,OTP,SCP; Packaging: Rail/Tube; Voltage - Output 1: 5V; Max Output Current: 1A; RoHS Compliant: Yes; ComponentLink1URL: http://www.farnell.com/datasheets/2192895.pdf?src-supplier=Farnell; ComponentLink1Description: http://www.farnell.com/datasheets/2192895.pdf?src-supplier=Farnell; ComponentLink2URL: http://www.farnell.com/datasheets/2192895.pdf?src-supplier=Newark; ComponentLink2Description: http://www.farnell.com/datasheets/2192895.pdf?src-supplier=Newark; ComponentLink3URL: https://katalog.we-online.de/pm/datasheet/173010542.pdf?src-supplier=Digi-Key; ComponentLink3Description: https://katalog.we-online.de/pm/datasheet/173010542.pdf?src-supplier=Digi-Key; Supplier Part Number 1: 1447809
F101 F102 = Fuse_1A_63V_1206: Fuse Chip Fast Acting 1A 63V SMD Solder Pad 1206 Ceramic T/R Automotive; Manufacturer: Littelfuse; Fuse Type: Board Mount (Cartridge Style Excluded); Approvals: CSA,cURus; .Creator: DO; Supplier 1: Digi-Key; Manufacturer Part Number: 0437001.WRA; RoHS: Yes; Category: Fuses; Stock 1: 5820; Pricing 1: 1=1,52000, 5=1,47000, 10=1,37600, 50=1,13860, 100=0,94880, 250=0,92508, 500=0,78276, 1000=0,68788 (USD); Mount: Surface Mount; Case/Package: 1206; Case Code (Imperial): 1206; Case Code (Metric): 3216; Min Operating Temperature: -55°C; Max Operating Temperature: 150°C; Packaging: Tape and Reel; Voltage Rating (AC): 63V; ComponentLink1URL: https://www.littelfuse.com/~/media/electronics/datasheets/fuses/littelfuse_fuse_437a_datasheet.pdf.pdf?src-supplier=Digi-Key; ComponentLink1Description: https://www.littelfuse.com/~/media/electronics/datasheets/fuses/littelfuse_fuse_437a_datasheet.pdf.pdf?src-supplier=Digi-Key; Supplier Part Number 1: F10001CT-ND; ComponentLink2Description: Where buy it; ComponentLink2URL: https://www.mouser.es/ProductDetail/Littelfuse/0437001WRA?qs=DXv0QSHKF4z9CJhPXjxR%252BA%3D%3D
J101 = J_Pinheader_1x3: 61300311121
L101 L102 = L_47u-490mA_CF: Inductor Power Unshielded Wirewound 47uH 10% 100KHz Ferrite 490mA 546mOhm DCR T/R; Manufacturer: Sumida; Manufacturer Part Number: CDC5D23BNP-470KC; DC Resistance (DCR): 546mR; .Creator: GP; Supplier 1: Mouser; RoHS: Yes; Category: Fixed Inductors; Stock 1: 3779; Pricing 1: 1=0,95000, 10=0,71100, 50=0,71100, 100=0,59700, 1000=0,40600, 10000=0,38100 (USD); Mount: Surface Mount; Case/Package: Nonstandard; Core Material: Ferrite; Weight: 0.007584oz; Min Operating Temperature: -40°C; Max Operating Temperature: 100°C; Tolerance: 10%; Shielding: Unshielded; Packaging: Tape and Reel; Package Quantity: 2000; Current Rating: 490mA; Inductance: 47uH; Max DC Current: 490mA; Termination: SMD/SMT; Test Frequency: 100kHz; Series: CDC5D23B; Length: 0.228inch; Width: 5.8mm; Height: 2.5mm; Height - Seated (Max): 0.098inch; Lead Free: Lead Free; RoHS Compliant: Yes; ComponentLink1URL: http://www.mouser.com/ds/2/390/CDC5D23B-465898.pdf?src-supplier=Mouser; ComponentLink1Description: http://www.mouser.com/ds/2/390/CDC5D23B-465898.pdf?src-supplier=Mouser; ComponentLink3URL: http://products.sumida.com/products/pdf/CDC5D23B.pdf?src-supplier=Digi-Key; ComponentLink3Description: http://products.sumida.com/products/pdf/CDC5D23B.pdf?src-supplier=Digi-Key; Supplier Part Number 1: 851-CDC5D23BNP-470KC
R101 R103 = R470-0805FTK: Res Thick Film 0805 470 Ohm 1% 1/8W ±100ppm/°C Molded SMD SMD Paper Tape on Plastic Reel; Manufacturer 1: Bourns; Power Rating: 125mW; Voltage Rating: 150V; .Creator: DR; Supplier 1: Arrow Electronics; Manufacturer Part Number 1: CR0805-FX-4700GLF; RoHS: Yes; Category: Chip SMD Resistors; Stock 1: 12623; Pricing 1: 1=0,00990, 10=0,00980, 25=0,00950, 50=0,00940, 100=0,00930, 250=0,00920, 500=0,00910, 1000=0,00890, 3000=0,00870, 6000=0,00860 (USD); Mount: Surface Mount; Case/Package: 0805; Number of Pins: 2; Case Code (Imperial): 0805; Case Code (Metric): 2012; Contact Plating: Tin; Min Operating Temperature: -55°C; Max Operating Temperature: 155°C; Packaging: Tape and Reel; Tolerance: 1%; Resistor Type: Thick Film; Termination: SMD/SMT; Temperature Coefficient: 100ppm/°C; Voltage Rating (DC): 150V; Features: Moisture Resistant; Series: CR0805; Max Power Dissipation: 125mW; Number of Terminations: 2; Resistance Tolerance: 1%; Construction: Rectangular; Technology: THICK FILM; Length: 2mm; Height: 0.5mm; Depth: 1.25mm; Thickness: 508um; Radiation Hardening: No; REACH SVHC: No SVHC; Military Standard: Not; ComponentLink1URL: https://datasheet.ciiva.com/11808/0900766b80fcdb72-11808686.pdf?src-supplier=RSComponents; ComponentLink1Description: https://datasheet.ciiva.com/11808/0900766b80fcdb72-11808686.pdf?src-supplier=RSComponents; ComponentLink2URL: https://datasheet.ciiva.com/7985/1856384-7985880.pdf?src-supplier=Element14; ComponentLink2Description: https://datasheet.ciiva.com/7985/1856384-7985880.pdf?src-supplier=Element14; ComponentLink3URL: https://datasheet.ciiva.com/22693/1902866-22693247.pdf?src-supplier=Element14; ComponentLink3Description: https://datasheet.ciiva.com/22693/1902866-22693247.pdf?src-supplier=Element14; ComponentLink4URL: https://datasheet.ciiva.com/5541/chpreztr-5541930.pdf?src-supplier=Mouser; ComponentLink4Description: https://datasheet.ciiva.com/5541/chpreztr-5541930.pdf?src-supplier=Mouser; Supplier Part Number 1: CR0805-FX-4700GLF
R102 = R100-0805FTK: Res Thick Film 0805 100 Ohm 1% 1/8W ±100ppm/°C Molded SMD SMD Paper Tape on Plastic Reel; Manufacturer 1: Bourns; Power Rating: 125mW; Voltage Rating: 150V; .Creator: DR; Supplier 1: Arrow Electronics; Manufacturer Part Number 1: CR0805-FX-1000ELF; RoHS: Yes; Category: Chip SMD Resistors; Stock 1: 49802; Pricing 1: 1=0,05840, 10=0,03430, 25=0,01780, 100=0,00750, 250=0,00560, 500=0,00490, 3000=0,00470 (USD); Mount: Surface Mount; Case/Package: 0805; Number of Pins: 2; Contact Plating: Tin; Case Code (Imperial): 0805; Case Code (Metric): 2012; Min Operating Temperature: -55°C; Max Operating Temperature: 155°C; Tolerance: 1%; Resistor Type: Thick Film; Temperature Coefficient: 100ppm/°C; Packaging: Tape and Reel; Package Quantity: 1; Termination: SMD/SMT; Number of Terminations: 2; Max Power Dissipation: 125mW; Voltage Rating (DC): 150V; Features: Moisture Resistant; Series: CR0805; Resistance Tolerance: 1%; Construction: Rectangular; Technology: THICK FILM; Length: 2mm; Width: 1.25mm; Height: 0.5mm; Depth: 1.25mm; Thickness: 508um; Radiation Hardening: No; REACH SVHC: No SVHC; Military Standard: Not; RoHS Compliant: Yes; ComponentLink1URL: https://datasheet.ciiva.com/11809/0900766b80fcdb72-11809178.pdf?src-supplier=RSComponents; ComponentLink1Description: https://datasheet.ciiva.com/11809/0900766b80fcdb72-11809178.pdf?src-supplier=RSComponents; ComponentLink2URL: https://datasheet.ciiva.com/6547/chpreztr-6547413.pdf?src-supplier=Digi-Key; ComponentLink2Description: https://datasheet.ciiva.com/6547/chpreztr-6547413.pdf?src-supplier=Digi-Key; ComponentLink3URL: https://datasheet.ciiva.com/6547/chpreztr-6547414.pdf?src-supplier=Digi-Key; ComponentLink3Description: https://datasheet.ciiva.com/6547/chpreztr-6547414.pdf?src-supplier=Digi-Key; ComponentLink4URL: https://datasheet.ciiva.com/6547/chpreztr-6547415.pdf?src-supplier=Digi-Key; ComponentLink4Description: https://datasheet.ciiva.com/6547/chpreztr-6547415.pdf?src-supplier=Digi-Key; ComponentLink5URL: https://datasheet.ciiva.com/9120/chpreztr-9120744.pdf?src-supplier=Avnet; ComponentLink5Description: https://datasheet.ciiva.com/9120/chpreztr-9120744.pdf?src-supplier=Avnet; Supplier Part Number 1: CR0805-FX-1000ELF
TP101 TP102 TP106 TP107 = TestPoint: Test Point 1x1 mm; .Creator: GP; Category: TestPoint; .PCBcheck: GP; .SCHcheck: GP
U101 = LDO_10V-0.8/3V3-SOT223: LDO Regulator Pos 3.3V 0.8A 4-Pin(3+Tab) SOT-223 T/R / IC REG LDO 3.3V 0.8A SOT223; Manufacturer: Texas Instruments; Number of Outputs: 1; Max Input Voltage: 15V; Max Output Current: 800mA; Polarity: Positive; Quiescent Current: 15mA; Accuracy: 1%; Output Type: Fixed; Dropout Voltage: 1.2V; Min Input Voltage: 2.6V; Max Supply Voltage: 10V; Min Supply Voltage: 4.75V; Current Rating: 800A; .Creator: GP; ComponentLink1URL: https://www.ti.com/lit/ds/symlink/lm1117.pdf?HQS=dis-mous-null-mousermode-dsf-pf-null-wwe&DCM=yes&ref_url=https%3A%2F%2Fwww.mouser.de%2F&distId=26; ComponentLink1Description: Datasheet; ComponentLink2Description: Where buy it; ComponentLink2URL: https://www.mouser.es/ProductDetail/Texas-Instruments/LM1117IMP-33-NOPB?qs=X1J7HmVL2ZFbpN1TgOsjYQ%3D%3D; Supplier 1: Digi-Key; Manufacturer Part Number: LM1117IMP-3.3/NOPB; RoHS: Yes; Category: LDO; Pricing 1: 1=1,41000, 10=1,26300, 25=1,19920, 100=0,98500, 250=0,92072, 500=0,81366 (USD); Mount: Surface Mount; Case/Package: SOT-223; Number of Pins: 4; Min Operating Temperature: -40°C; Max Operating Temperature: 125°C; Output Voltage: 3.3V; Packaging: Tape and Reel; Output Current: 800mA; Nominal Output Voltage: 3.3V; Termination: SMD/SMT; Output Voltage Accuracy: 1%; Number of Regulators: 1; Min Current Limit: 800mA; Package Quantity: 1000; Length: 6.5mm; Width: 3.56mm; Height: 1.6mm; Radiation Hardening: No; REACH SVHC: No SVHC; Lead Free: Lead Free; RoHS Compliant: Yes; ComponentLink3URL: https://datasheet.ciiva.com/27051/1281318-27051810.pdf?src-supplier=Jameco; ComponentLink3Description: https://datasheet.ciiva.com/27051/1281318-27051810.pdf?src-supplier=Jameco; ComponentLink4URL: https://datasheet.ciiva.com/8042/1670636-8042261.pdf?src-supplier=Element14; ComponentLink4Description: https://datasheet.ciiva.com/8042/1670636-8042261.pdf?src-supplier=Element14; ComponentLink5URL: https://datasheet.ciiva.com/1570/1849796-1570171.pdf?src-supplier=Farnell; ComponentLink5Description: https://datasheet.ciiva.com/1570/1849796-1570171.pdf?src-supplier=Farnell; ComponentLink6URL: https://datasheet.ciiva.com/14149/lm1117-eng-tds-14149980.pdf?src-supplier=Distrelec; ComponentLink6Description: https://datasheet.ciiva.com/14149/lm1117-eng-tds-14149980.pdf?src-supplier=Distrelec; ComponentLink7URL: https://datasheet.ciiva.com/46386/1882372-46386042.pdf?src-supplier=Element14; ComponentLink7Description: https://datasheet.ciiva.com/46386/1882372-46386042.pdf?src-supplier=Element14; ComponentLink8URL: https://datasheet.ciiva.com/3223/lm1117-n-3223515.pdf?src-supplier=Avnet; ComponentLink8Description: https://datasheet.ciiva.com/3223/lm1117-n-3223515.pdf?src-supplier=Avnet; ComponentLink9URL: https://datasheet.ciiva.com/6580/lm1117-n-6580030.pdf?src-supplier=Digi-Key; ComponentLink9Description: https://datasheet.ciiva.com/6580/lm1117-n-6580030.pdf?src-supplier=Digi-Key; ComponentLink10URL: https://datasheet.ciiva.com/6580/lm1117-n-6580026.pdf?src-supplier=Digi-Key; ComponentLink10Description: https://datasheet.ciiva.com/6580/lm1117-n-6580026.pdf?src-supplier=Digi-Key; Supplier Part Number 1: LM1117IMP-3.3/NOPBCT-ND